# Altium schematic sheet 11_5V_RAIL_ADC.SchDoc
size A4
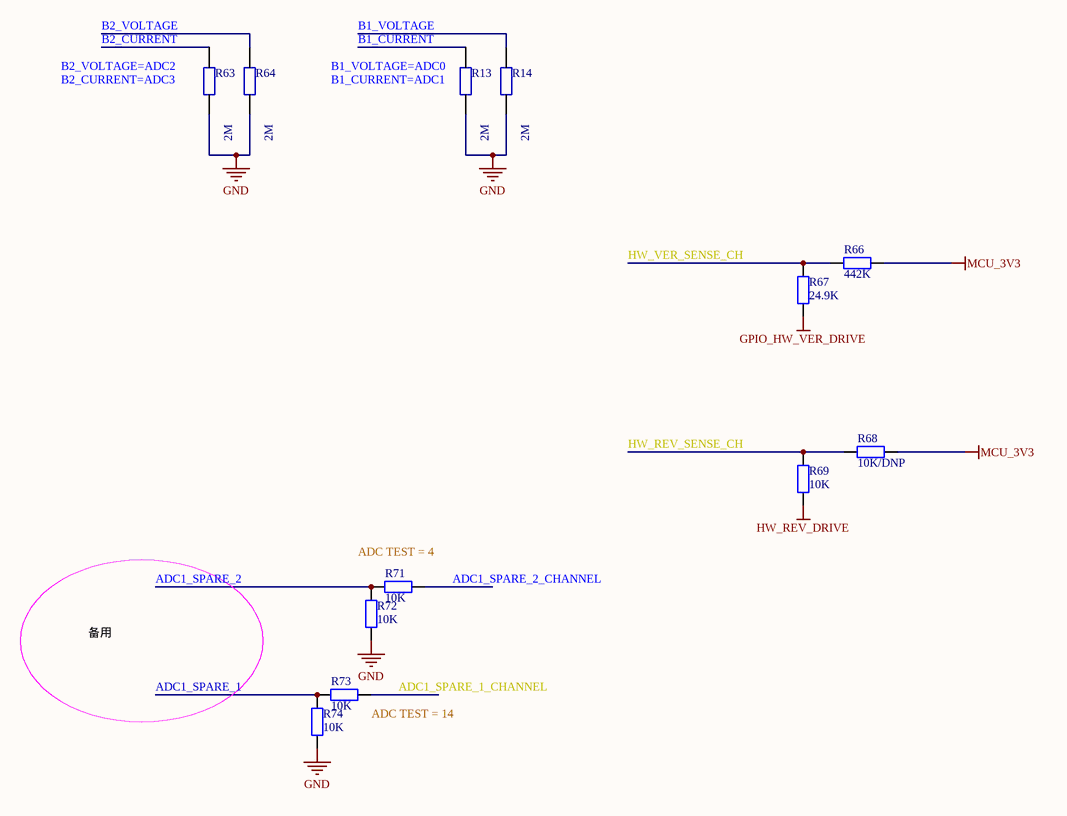
[diagram p0: 11_5V_RAIL_ADC.SchDoc]

## Parts
R13  2M  [0402R]
R14  2M  [0402R]
R63  2M  [0402R]
R64  2M  [0402R]
R66  442K  [R0402]
R67  24.9K  [R0402]
R68  10K/DNP  [R0402]
R69  10K  [R0402]
R71  10K  [R0402]
R72  10K  [R0402]
R73  10K  [R0402]
R74  10K  [R0402]

## Nets
GND: R13.2 R14.2 R63.2 R64.2 R72.1 R74.1
GPIO_HW_VER_DRIVE: R67.1
HW_REV_DRIVE: R69.1
MCU_3V3: R66.2 R68.2
ADC1_SPARE_1: R73.1 R74.2
ADC1_SPARE_1_CHANNEL: R73.2
ADC1_SPARE_2: R71.1 R72.2
ADC1_SPARE_2_CHANNEL: R71.2
B1_CURRENT: R13.1
B1_VOLTAGE: R14.1
B2_CURRENT: R63.1
B2_VOLTAGE: R64.1
HW_REV_SENSE_CH: R68.1 R69.2
HW_VER_SENSE_CH: R66.1 R67.2

## Notes on the sheet
- Labels drawn without touching a wire or pin: ADC TEST = 4, ADC TEST = 14, B1_CURRENT=ADC1, B1_VOLTAGE=ADC0, B2_CURRENT=ADC3, B2_VOLTAGE=ADC2, 备用

## Library data of the parts
R13 R14 R63 R64 = 0402R10K: 0402R10K 1%
R66-R69 R71-R74 = Res2: Resistor; Value: 1K; Published: 8-Jun-2000; LatestRevisionDate: 17-Jul-2002; LatestRevisionNote: Re-released for DXP Platform.; PackageReference: AXIAL-0.4; Publisher: Altium Limited; PackageDescription: Axial Device, Thru-Hole; 2 Leads; 0.4 in Pin Spacing